# Altium schematic sheet interface.SchDoc
size A2; SheetNumber: 1; SheetTotal: 1
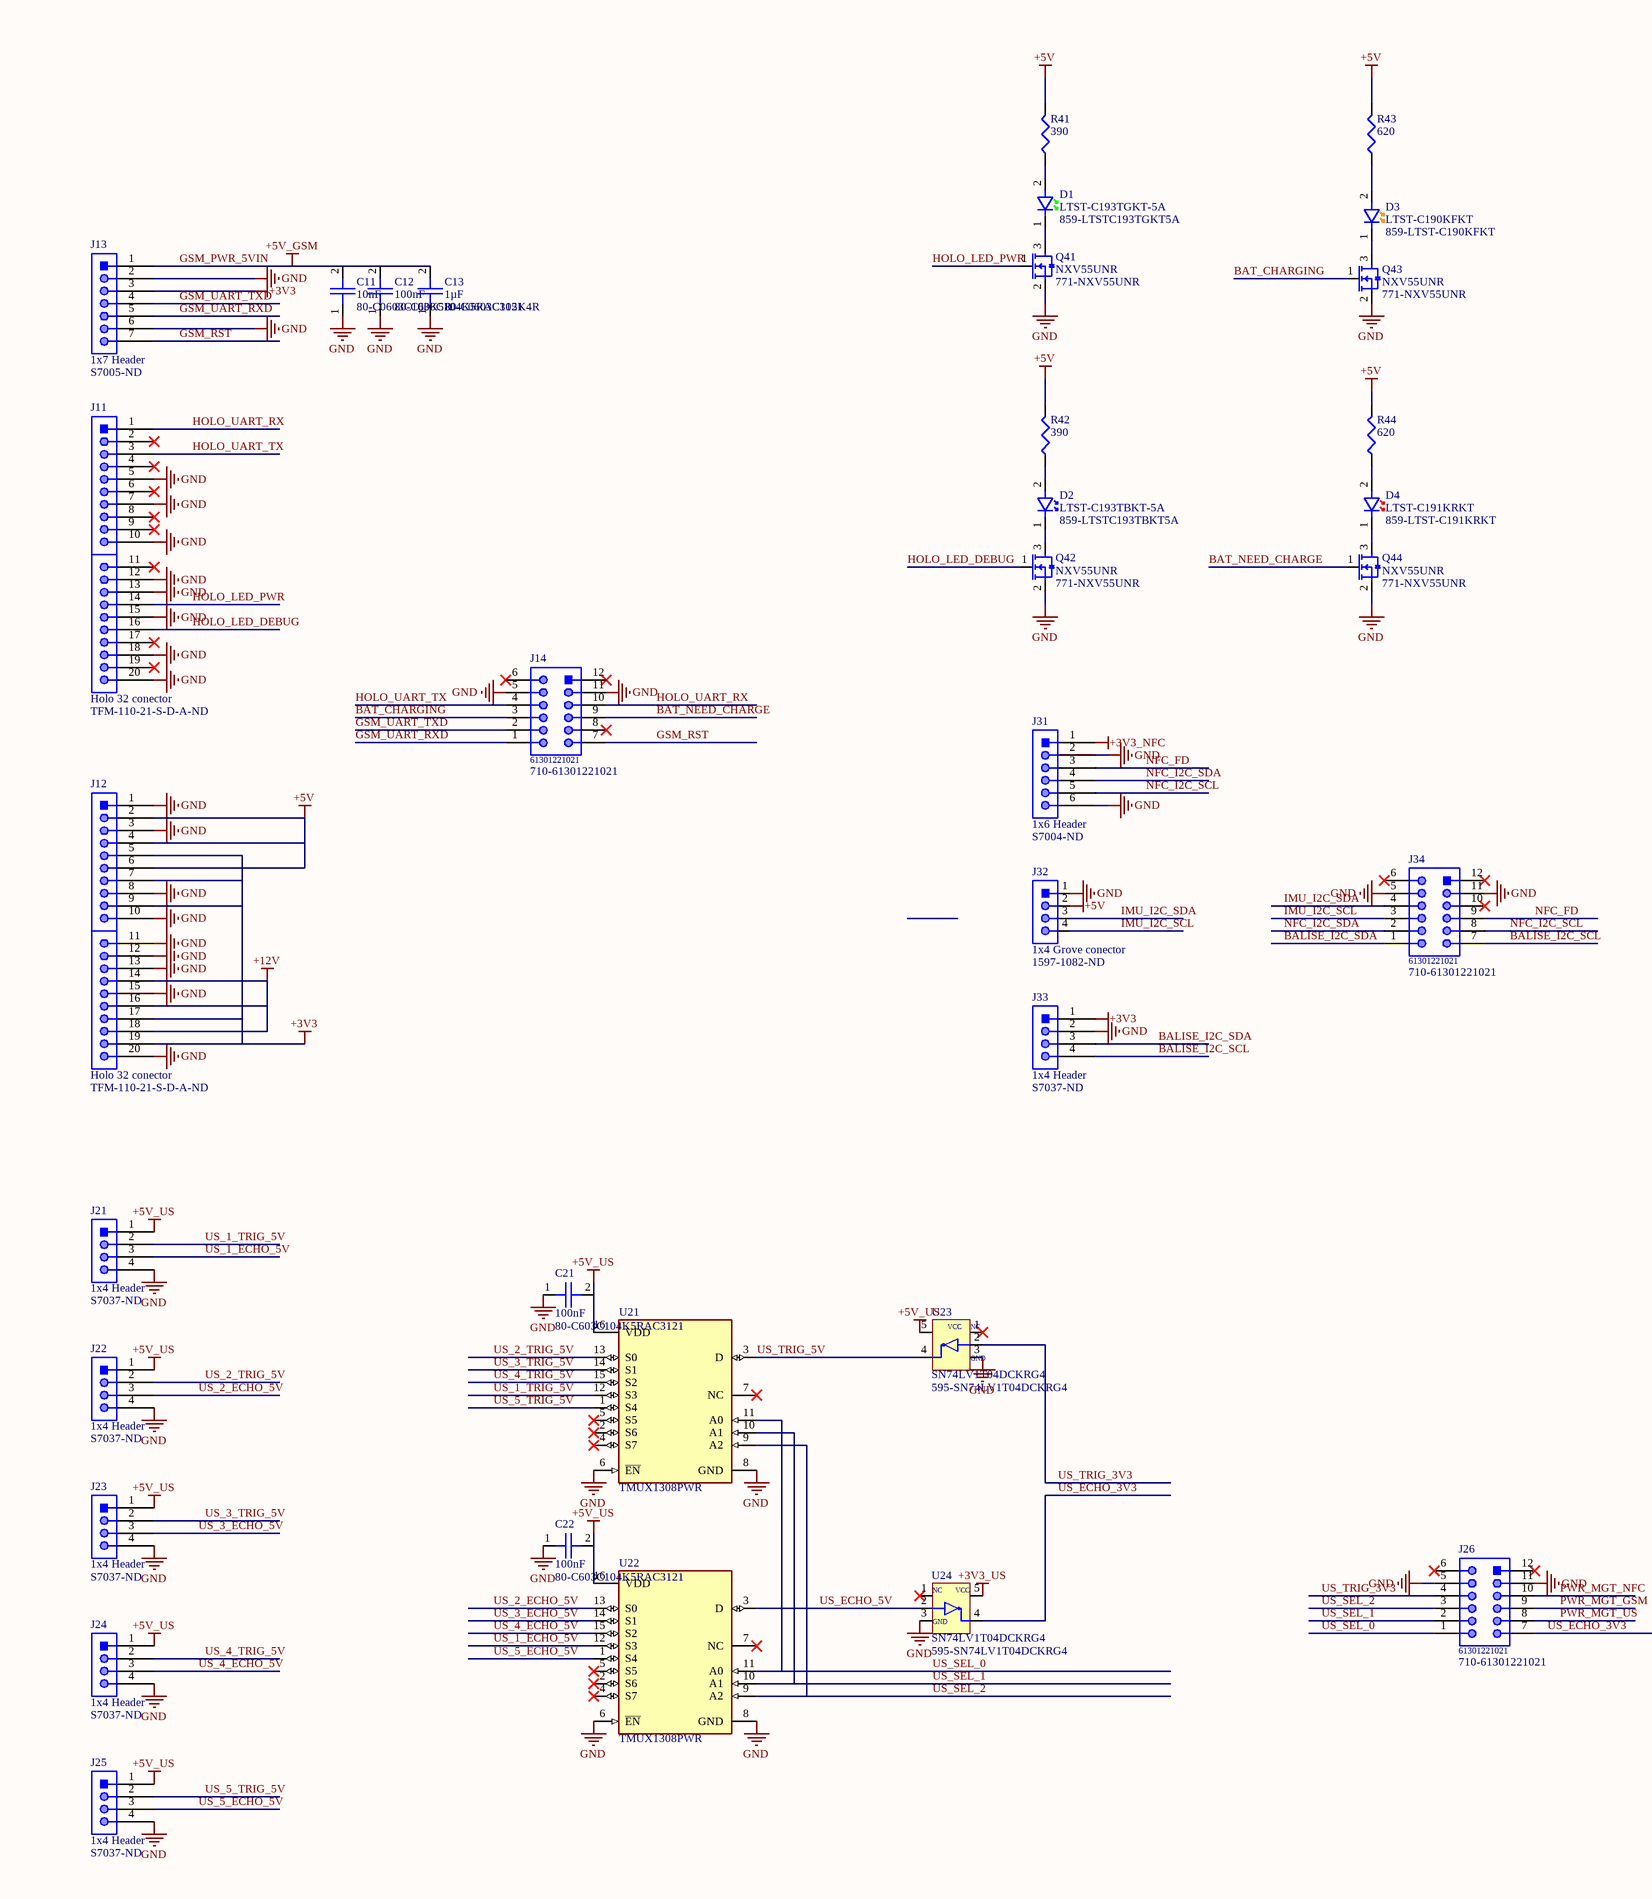
[diagram p0: interface.SchDoc, left]
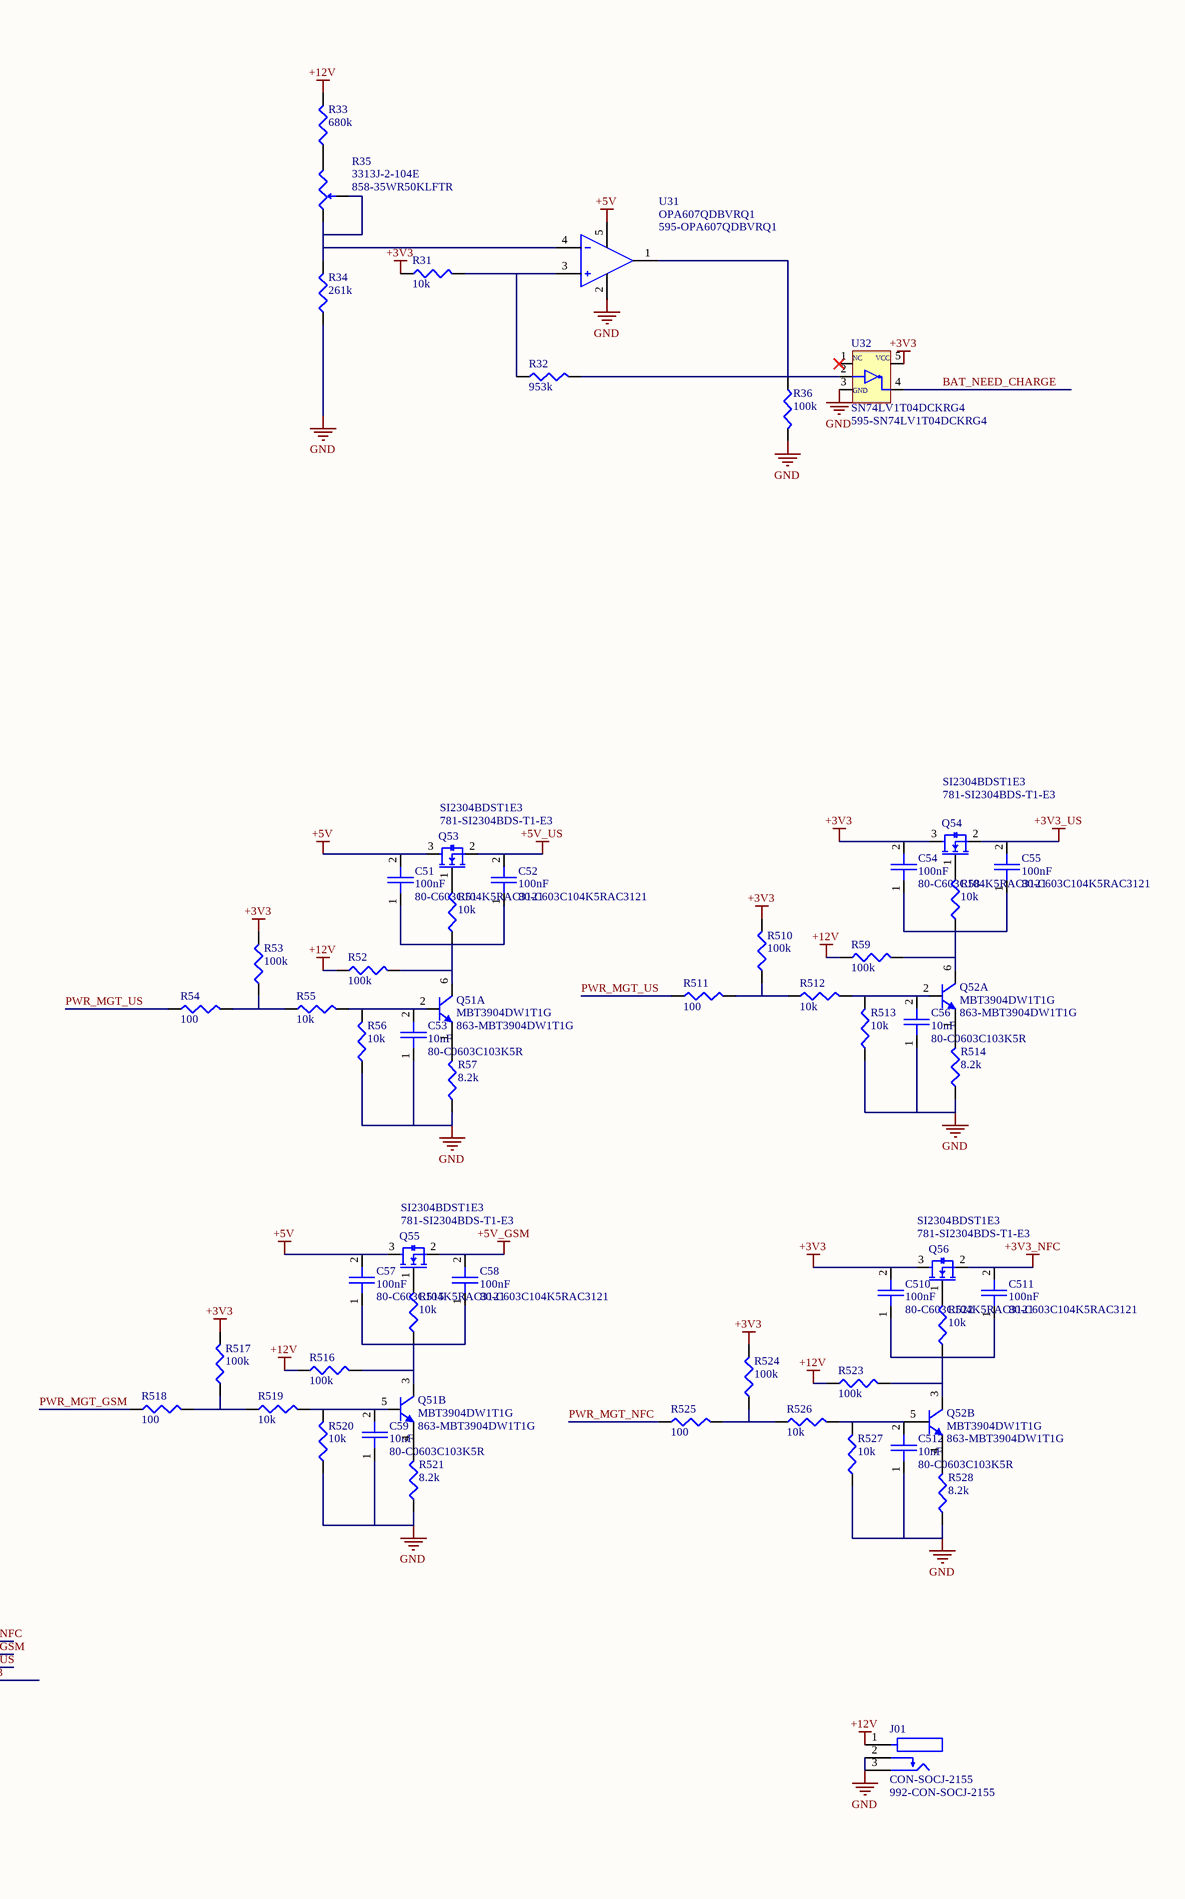
[diagram p1: interface.SchDoc, right]

## Parts
C11  10nF  Supplier Part Number 1: 80-C0603C103K5R  [FP-C0603C-CF-IPC_A]
C12  100nF  Supplier Part Number 1: 80-C603C104K5RAC3121  [FP-C0603C104K5RAC3121-IPC_A]
C13  1µF  Supplier Part Number 1: 80-C0603C105K4R  [CAPC1608X90X35NL15T15]
C21  100nF  Supplier Part Number 1: 80-C603C104K5RAC3121  [FP-C0603C104K5RAC3121-IPC_A]
C22  100nF  Supplier Part Number 1: 80-C603C104K5RAC3121  [FP-C0603C104K5RAC3121-IPC_A]
C51  100nF  Supplier Part Number 1: 80-C603C104K5RAC3121  [FP-C0603C104K5RAC3121-IPC_A]
C52  100nF  Supplier Part Number 1: 80-C603C104K5RAC3121  [FP-C0603C104K5RAC3121-IPC_A]
C53  10nF  Supplier Part Number 1: 80-C0603C103K5R  [FP-C0603C-CF-IPC_A]
C54  100nF  Supplier Part Number 1: 80-C603C104K5RAC3121  [FP-C0603C104K5RAC3121-IPC_A]
C55  100nF  Supplier Part Number 1: 80-C603C104K5RAC3121  [FP-C0603C104K5RAC3121-IPC_A]
C56  10nF  Supplier Part Number 1: 80-C0603C103K5R  [FP-C0603C-CF-IPC_A]
C57  100nF  Supplier Part Number 1: 80-C603C104K5RAC3121  [FP-C0603C104K5RAC3121-IPC_A]
C58  100nF  Supplier Part Number 1: 80-C603C104K5RAC3121  [FP-C0603C104K5RAC3121-IPC_A]
C59  10nF  Supplier Part Number 1: 80-C0603C103K5R  [FP-C0603C-CF-IPC_A]
C510  100nF  Supplier Part Number 1: 80-C603C104K5RAC3121  [FP-C0603C104K5RAC3121-IPC_A]
C511  100nF  Supplier Part Number 1: 80-C603C104K5RAC3121  [FP-C0603C104K5RAC3121-IPC_A]
C512  10nF  Supplier Part Number 1: 80-C0603C103K5R  [FP-C0603C-CF-IPC_A]
D1  LTST-C193TGKT-5A  Supplier Part Number 1: 859-LTSTC193TGKT5A  [FP-LTST-C193TGKT-5A]
D2  LTST-C193TBKT-5A  Supplier Part Number 1: 859-LTSTC193TBKT5A  [FP-LTST-C193TBKT-5A-MFG]
D3  LTST-C190KFKT  Supplier Part Number 1: 859-LTST-C190KFKT  [FP-LTST-C190KFKT-MFG]
D4  LTST-C191KRKT  Supplier Part Number 1: 859-LTST-C191KRKT  [FP-LTST-C191KRKT]
J01  CON-SOCJ-2155  Supplier Part Number 1: 992-CON-SOCJ-2155  [GRAVITECH_CON-SOCJ-2155]
J11  Holo 32 conector  Supplier Part Number 1: TFM-110-21-S-D-A-ND  [SAMTEC_TFM-110-21-S-D-A]
J12  Holo 32 conector  Supplier Part Number 1: TFM-110-21-S-D-A-ND  [SAMTEC_TFM-110-21-S-D-A]
J13  1x7 Header  Supplier Part Number 1: S7005-ND  [header 1x7]
J14  61301221021  Supplier Part Number 1: 710-61301221021  [61301221021]
J21  1x4 Header  Supplier Part Number 1: S7037-ND  [header 1x4]
J22  1x4 Header  Supplier Part Number 1: S7037-ND  [header 1x4]
J23  1x4 Header  Supplier Part Number 1: S7037-ND  [header 1x4]
J24  1x4 Header  Supplier Part Number 1: S7037-ND  [header 1x4]
J25  1x4 Header  Supplier Part Number 1: S7037-ND  [header 1x4]
J26  61301221021  Supplier Part Number 1: 710-61301221021  [61301221021]
J31  1x6 Header  Supplier Part Number 1: S7004-ND  [header 1x6]
J32  1x4 Grove conector  Supplier Part Number 1: 1597-1082-ND  [FP-110990030]
J33  1x4 Header  Supplier Part Number 1: S7037-ND  [header 1x4]
J34  61301221021  Supplier Part Number 1: 710-61301221021  [61301221021]
Q41  NXV55UNR  Supplier Part Number 1: 771-NXV55UNR  [SOT95P230X110-3N]
Q42  NXV55UNR  Supplier Part Number 1: 771-NXV55UNR  [SOT95P230X110-3N]
Q43  NXV55UNR  Supplier Part Number 1: 771-NXV55UNR  [SOT95P230X110-3N]
Q44  NXV55UNR  Supplier Part Number 1: 771-NXV55UNR  [SOT95P230X110-3N]
Q51  MBT3904DW1T1G  Supplier Part Number 1: 863-MBT3904DW1T1G  [ONSC-SOT-363-6-419B-02_W_V]  (parts A,B of 2)
Q52  MBT3904DW1T1G  Supplier Part Number 1: 863-MBT3904DW1T1G  [ONSC-SOT-363-6-419B-02_W_V]  (parts A,B of 2)
Q53  SI2304BDST1E3  Supplier Part Number 1: 781-SI2304BDS-T1-E3  [FP-SI2304BDST1E3]
Q54  SI2304BDST1E3  Supplier Part Number 1: 781-SI2304BDS-T1-E3  [FP-SI2304BDST1E3]
Q55  SI2304BDST1E3  Supplier Part Number 1: 781-SI2304BDS-T1-E3  [FP-SI2304BDST1E3]
Q56  SI2304BDST1E3  Supplier Part Number 1: 781-SI2304BDS-T1-E3  [FP-SI2304BDST1E3]
R31  10k  [RESC2013X50X30ML20T20]
R32  953k  [RESC2013X50X30ML20T20]
R33  680k  [RESC2013X50X30ML20T20]
R34  261k  [RESC2013X50X30ML20T20]
R35  3313J-2-104E  Supplier Part Number 1: 858-35WR50KLFTR  [FP-3313J-2-104E]
R36  100k  [RESC2013X50X30ML20T20]
R41  390  [RESC2013X50X30ML20T20]
R42  390  [RESC2013X50X30ML20T20]
R43  620  [RESC2013X50X30ML20T20]
R44  620  [RESC2013X50X30ML20T20]
R51  10k  [RESC2013X50X30ML20T20]
R52  100k  [RESC2013X50X30ML20T20]
R53  100k  [RESC2013X50X30ML20T20]
R54  100  [RESC2013X50X30ML20T20]
R55  10k  [RESC2013X50X30ML20T20]
R56  10k  [RESC2013X50X30ML20T20]
R57  8.2k  [RESC2013X50X30ML20T20]
R58  10k  [RESC2013X50X30ML20T20]
R59  100k  [RESC2013X50X30ML20T20]
R510  100k  [RESC2013X50X30ML20T20]
R511  100  [RESC2013X50X30ML20T20]
R512  10k  [RESC2013X50X30ML20T20]
R513  10k  [RESC2013X50X30ML20T20]
R514  8.2k  [RESC2013X50X30ML20T20]
R515  10k  [RESC2013X50X30ML20T20]
R516  100k  [RESC2013X50X30ML20T20]
R517  100k  [RESC2013X50X30ML20T20]
R518  100  [RESC2013X50X30ML20T20]
R519  10k  [RESC2013X50X30ML20T20]
R520  10k  [RESC2013X50X30ML20T20]
R521  8.2k  [RESC2013X50X30ML20T20]
R522  10k  [RESC2013X50X30ML20T20]
R523  100k  [RESC2013X50X30ML20T20]
R524  100k  [RESC2013X50X30ML20T20]
R525  100  [RESC2013X50X30ML20T20]
R526  10k  [RESC2013X50X30ML20T20]
R527  10k  [RESC2013X50X30ML20T20]
R528  8.2k  [RESC2013X50X30ML20T20]
U21  TMUX1308PWR  [FP-PW0016A-IPC_A]
U22  TMUX1308PWR  [FP-PW0016A-IPC_A]
U23  SN74LV1T04DCKRG4  Supplier Part Number 1: 595-SN74LV1T04DCKRG4  [SOT65P210X110-5N]
U24  SN74LV1T04DCKRG4  Supplier Part Number 1: 595-SN74LV1T04DCKRG4  [SOT65P210X110-5N]
U31  OPA607QDBVRQ1  Supplier Part Number 1: 595-OPA607QDBVRQ1  [FP-DBV0005A-IPC_A]
U32  SN74LV1T04DCKRG4  Supplier Part Number 1: 595-SN74LV1T04DCKRG4  [SOT65P210X110-5N]

## Nets
+3V3: C54.2 C510.2 J12.5 J12.7 J12.9 J12.17 J12.19 J13.3 J33.1 Q54.3 Q56.3 R31.1 R53.2 R510.2 R517.2 R524.2 U32.5(VCC)
+3V3_NFC: C511.2 J31.1 Q56.2
+3V3_US: C55.2 Q54.2 U24.5(VCC)
+5V: C51.2 C57.2 J12.2 J12.4 J12.6 J32.2 Q53.3 Q55.3 R41.2 R42.2 R43.2 R44.2 U31.5(VS+)
+5V_US: C21.2 C22.2 C52.2 J21.1 J22.1 J23.1 J24.1 J25.1 Q53.2 U21.16(VDD) U22.16(VDD) U23.5(VCC)
+12V: J01.1 J12.14 J12.16 J12.18 R33.2 R52.1 R59.1 R516.1 R523.1
GND: C11.1 C12.1 C13.1 C21.1 C22.1 C53.1 C56.1 C59.1 C512.1 J01.2 J01.3 J11.5 J11.7 J11.10 J11.12 J11.13 J11.15 J11.18 J11.20 J12.1 J12.3 J12.8 J12.10 J12.11 J12.12 J12.13 J12.15 J12.20 J13.2 J13.6 J14.5 J14.11 J21.4 J22.4 J23.4 J24.4 J25.4 J26.5 J26.11 J31.2 J31.6 J32.1 J33.2 J34.5 J34.11 Q41.2 Q42.2 Q43.2 Q44.2 R34.1 R36.2 R56.1 R57.1 R513.1 R514.1 R520.1 R521.1 R527.1 R528.1 U21.6(~{EN}) U21.8(GND) U22.6(~{EN}) U22.8(GND) U23.3(GND) U24.3(GND) U31.2(VS-) U32.3(GND)
GSM_PWR_5VIN: C11.2 C12.2 C13.2 C58.2 J13.1 Q55.2  [also labelled +5V_GSM]
BALISE_I2C_SCL: J33.4 J34.7
BALISE_I2C_SDA: J33.3 J34.1
BAT_CHARGING: J14.3 Q43.1
BAT_NEED_CHARGE: J14.9 Q44.1 U32.4
GSM_RST: J13.7 J14.7
GSM_UART_RXD: J13.5 J14.1
GSM_UART_TXD: J13.4 J14.2
HOLO_LED_DEBUG: J11.16 Q42.1
HOLO_LED_PWR: J11.14 Q41.1
HOLO_UART_RX: J11.1 J14.10
HOLO_UART_TX: J11.3 J14.4
IMU_I2C_SCL: J32.4 J34.3
IMU_I2C_SDA: J32.3 J34.4
NFC_FD: J31.3 J34.9
NFC_I2C_SCL: J31.5 J34.8
NFC_I2C_SDA: J31.4 J34.2
PWR_MGT_GSM: J26.9 R518.1
PWR_MGT_NFC: J26.10 R525.1
PWR_MGT_US: J26.8 R54.1 R511.1
US_1_ECHO_5V: J21.3 U22.12(S3)
US_1_TRIG_5V: J21.2 U21.12(S3)
US_2_ECHO_5V: J22.3 U22.13(S0)
US_2_TRIG_5V: J22.2 U21.13(S0)
US_3_ECHO_5V: J23.3 U22.14(S1)
US_3_TRIG_5V: J23.2 U21.14(S1)
US_4_ECHO_5V: J24.3 U22.15(S2)
US_4_TRIG_5V: J24.2 U21.15(S2)
US_5_ECHO_5V: J25.3 U22.1(S4)
US_5_TRIG_5V: J25.2 U21.1(S4)
US_ECHO_3V3: J26.7 U24.4
US_ECHO_5V: U22.3(D) U24.2
US_SEL_0: J26.1 U21.11(A0) U22.11(A0)
US_SEL_1: J26.2 U21.10(A1) U22.10(A1)
US_SEL_2: J26.3 U21.9(A2) U22.9(A2)
US_TRIG_3V3: J26.4 U23.2
US_TRIG_5V: U21.3(D) U23.4
NetC51_1: C51.1 C52.1 Q51.6(C) R51.1 R52.2
NetC53_2: C53.2 Q51.2(B) R55.2 R56.2
NetC54_1: C54.1 C55.1 Q52.6(C) R58.1 R59.2
NetC56_2: C56.2 Q52.2(B) R512.2 R513.2
NetC57_1: C57.1 C58.1 Q51.3(C) R515.1 R516.2
NetC59_2: C59.2 Q51.5(B) R519.2 R520.2
NetC510_1: C510.1 C511.1 Q52.3(C) R522.1 R523.2
NetC512_2: C512.2 Q52.5(B) R526.2 R527.2
NetD1_1: D1.1 Q41.3
NetD1_2: D1.2 R41.1
NetD2_1: D2.1 Q42.3
NetD2_2: D2.2 R42.1
NetD3_1: D3.1 Q43.3
NetD3_2: D3.2 R43.1
NetD4_1: D4.1 Q44.3
NetD4_2: D4.2 R44.1
NetQ51_1: Q51.1(E) R57.2
NetQ51_4: Q51.4(E) R521.2
NetQ52_1: Q52.1(E) R514.2
NetQ52_4: Q52.4(E) R528.2
NetQ53_1: Q53.1 R51.2
NetQ54_1: Q54.1 R58.2
NetQ55_1: Q55.1 R515.2
NetQ56_1: Q56.1 R522.2
NetR31_2: R31.2 R32.1 U31.3(IN+)
NetR32_2: R32.2 R36.1 U31.1(OUT) U32.2
NetR33_1: R33.1 R35.2
NetR34_2: R34.2 R35.1 R35.3 U31.4(IN-)
NetR53_1: R53.1 R54.2 R55.1
NetR510_1: R510.1 R511.2 R512.1
NetR517_1: R517.1 R518.2 R519.1
NetR524_1: R524.1 R525.2 R526.1

Not connected (* = marked no-connect by the designer): J11 2* 4* 6* 8* 9* 11* 17* 19*; J14 6* 8* 12*; J26 6* 12*; J34 6* 10* 12*; U21 2(S6)* 4(S7)* 5(S5)* 7(NC)*; U22 2(S6)* 4(S7)* 5(S5)* 7(NC)*; U23 1(NC)*; U24 1(NC)*; U32 1(NC)*

## Library data of the parts
C11 C53 C56 C59 C512 = C0603C103K5RACTU: CAP CER 10000PF 50V X7R 0603; Manufacturer: KEMET; Dielectric Material: Ceramic; Tolerance: 10%; Dissipation Factor: 2.5%; Supplier 1: Mouser; Manufacturer Part Number: C0603C103K5RACTU; RoHS: Yes; Category: Ceramic Capacitors; Stock 1: 1844699; Pricing 1: 1=0,16000, 10=0,07400, 50=0,07400, 100=0,03300, 500=0,02400, 1000=0,01900, 2000=0,01700, 4000=0,01500, 8000=0,01300, 10000=0,01300 (USD); Mount: Surface Mount,PCB; Case/Package: 0603; Number of Pins: 2; Case Code (Metric): 1608; Case Code (Imperial): 0603; Contact Plating: Tin,Matte; Min Operating Temperature: -55°C; Max Operating Temperature: 125°C; Capacitance: 10nF; Dielectric: X7R; Voltage Rating: 50V; Voltage Rating (DC): 50V; Packaging: Tape and Reel; Package Quantity: 4000; Termination: SMD/SMT; Voltage: 50V; Series: C0603C; Construction: Flat; Length: 1.6mm; Width: 0.8mm; Height: 0.8mm; Thickness: 0.034inch; Lead Pitch: 0.7mm; Depth: 0.8mm; Radiation Hardening: No; REACH SVHC: No SVHC; RoHS Compliant: Yes; ComponentLink1URL: https://datasheet.ciiva.com/7823/1732718-7823585.pdf?src-supplier=Element14; ComponentLink1Description: https://datasheet.ciiva.com/7823/1732718-7823585.pdf?src-supplier=Element14; ComponentLink2URL: https://datasheet.ciiva.com/5904/kem-c1002-x7r-smd-5904645.pdf?src-supplier=Farnell; ComponentLink2Description: https://datasheet.ciiva.com/5904/kem-c1002-x7r-smd-5904645.pdf?src-supplier=Farnell; ComponentLink3URL: https://datasheet.ciiva.com/7823/kem-c1002-x7r-smd-7823976.pdf?src-supplier=Element14; ComponentLink3Description: https://datasheet.ciiva.com/7823/kem-c1002-x7r-smd-7823976.pdf?src-supplier=Element14; ComponentLink4URL: https://datasheet.ciiva.com/7823/1918693-7823978.pdf?src-supplier=Element14; ComponentLink4Description: https://datasheet.ciiva.com/7823/1918693-7823978.pdf?src-supplier=Element14; ComponentLink5URL: https://datasheet.ciiva.com/28645/1851736-28645598.pdf?src-supplier=Element14; ComponentLink5Description: https://datasheet.ciiva.com/28645/1851736-28645598.pdf?src-supplier=Element14; ComponentLink6URL: https://datasheet.ciiva.com/7823/kem-c1002-x7r-smd-7823977.pdf?src-supplier=Element14; ComponentLink6Description: https://datasheet.ciiva.com/7823/kem-c1002-x7r-smd-7823977.pdf?src-supplier=Element14; ComponentLink7URL: https://datasheet.ciiva.com/14585/70095383-14585450.pdf?src-supplier=Allied+Electronics; ComponentLink7Description: https://datasheet.ciiva.com/14585/70095383-14585450.pdf?src-supplier=Allied+Electronics; ComponentLink8URL: https://datasheet.ciiva.com/5416/kem-c1002-x7r-smd-5416028.pdf?src-supplier=Mouser; ComponentLink8Description: https://datasheet.ciiva.com/5416/kem-c1002-x7r-smd-5416028.pdf?src-supplier=Mouser; ComponentLink9URL: https://datasheet.ciiva.com/39122/kem-c1002-x7r-smd-39122903.pdf?src-supplier=Onlinecomponents.com; ComponentLink9Description: https://datasheet.ciiva.com/39122/kem-c1002-x7r-smd-39122903.pdf?src-supplier=Onlinecomponents.com; ComponentLink10URL: https://datasheet.ciiva.com/18192/getdatasheetpartid-308803-18192662.pdf?src-supplier=Verical; ComponentLink10Description: https://datasheet.ciiva.com/18192/getdatasheetpartid-308803-18192662.pdf?src-supplier=Verical; ComponentLink11URL: https://datasheet.ciiva.com/18101/getdatasheetpartid-58468-18101898.pdf?src-supplier=Verical; ComponentLink11Description: https://datasheet.ciiva.com/18101/getdatasheetpartid-58468-18101898.pdf?src-supplier=Verical
C12 C21 C22 C51 C52 C54 C55 C57 C58 C510 C511 = C0603C104K5RAC3121: Cap Ceramic 0.1uF 50V X7R 10% Pad SMD 0603 125°C T/R; Manufacturer: KEMET; Supplier 1: Mouser; Manufacturer Part Number: C0603C104K5RAC3121; RoHS: Yes; Category: Ceramic Capacitors; Stock 1: 3306727; Pricing 1: 1=0,13000, 10=0,09200, 50=0,09200, 100=0,04300, 1000=0,02500, 10000=0,01900 (USD); Case/Package: 0603; RoHS Compliant: Yes
C13 = C0603C105K4RACTU: Cap Ceramic 1uF 16V X7R 10% SMD 0603 125°C Paper T/R; Manufacturer: KEMET; Dissipation Factor: 3.5%; Supplier 1: Mouser; Manufacturer Part Number: C0603C105K4RACTU; RoHS: Yes; Category: Ceramic Capacitors; Stock 1: 3280807; Pricing 1: 1=0,17000, 10=0,08000, 50=0,08000, 100=0,03600, 500=0,02600, 1000=0,02000, 2000=0,01900, 4000=0,01600, 8000=0,01400, 10000=0,01400 (USD); Mount: Surface Mount,PCB; Case/Package: 0603; Number of Pins: 2; Case Code (Metric): 1608; Case Code (Imperial): 0603; Contact Plating: Tin,Matte; Dielectric Material: Ceramic; Min Operating Temperature: -55°C; Max Operating Temperature: 125°C; Package Quantity: 4000; Capacitance: 1uF; Voltage Rating: 16V; Tolerance: 10%; Packaging: Tape and Reel; Voltage Rating (DC): 16V; Dielectric: X7R; Termination: SMD/SMT; Voltage: 16V; Series: C0603C; Construction: Flat; Length: 1.6mm; Width: 0.031inch; Height: 0.8mm; Thickness: 0.034inch; Depth: 0.8mm; Radiation Hardening: No; REACH SVHC: No SVHC; RoHS Compliant: Yes; ComponentLink1URL: https://datasheet.ciiva.com/7823/kem-c1002-x7r-smd-7823997.pdf?src-supplier=Element14; ComponentLink1Description: https://datasheet.ciiva.com/7823/kem-c1002-x7r-smd-7823997.pdf?src-supplier=Element14; ComponentLink2URL: https://datasheet.ciiva.com/22749/kem-c1002-x7r-smd-22749721.pdf?src-supplier=Element14; ComponentLink2Description: https://datasheet.ciiva.com/22749/kem-c1002-x7r-smd-22749721.pdf?src-supplier=Element14; ComponentLink3URL: https://datasheet.ciiva.com/5419/kem-c1002-x7r-smd-5419750.pdf?src-supplier=Mouser; ComponentLink3Description: https://datasheet.ciiva.com/5419/kem-c1002-x7r-smd-5419750.pdf?src-supplier=Mouser; ComponentLink4URL: https://datasheet.ciiva.com/18192/getdatasheetpartid-385479-18192732.pdf?src-supplier=Verical; ComponentLink4Description: https://datasheet.ciiva.com/18192/getdatasheetpartid-385479-18192732.pdf?src-supplier=Verical
D1 = LTST-C193TGKT-5A: 0603(H=0.35mm) 绿色 λD=520nm~535nm VR=5V VF=2.5V~3.1V IF=5mA PD=76mW; Manufacturer: Vishay Lite-On; Color: Green; Lens Color: Colorless; Forward Current: 5mA; Forward Voltage: 3.1V; Luminous Intensity: 280mcd; Viewing Angle: 130°; Lens Style: Diffused,Colorless,Rectangular; Lens Transparency: Clear; Dominant Wavelength: 535nm; Number of Elements: 1; Power Dissipation: 76mW; Reverse Voltage: 5V; Supplier 1: Mouser; Manufacturer Part Number: LTST-C193TGKT-5A; RoHS: Yes; Category: LEDs; Stock 1: 78292; Pricing 1: 1=0,44000, 10=0,27500, 50=0,27500, 100=0,15800, 1000=0,12400, 5000=0,11300, 10000=0,09600, 25000=0,09200, 50000=0,08900 (USD); Mount: Surface Mount; Case/Package: 0603; Number of Pins: 2; Case Code (Metric): 1608; Case Code (Imperial): 0603; Min Operating Temperature: -20°C; Max Operating Temperature: 80°C; Illumination Color: Green; Packaging: Tape and Reel; Package Quantity: 3000; Test Current: 5mA; Number of LEDs: 1; Series: -; Length: 1.6mm; Width: 0.8mm; Height: 0.35mm; Depth: 0.8mm; Radiation Hardening: No; Lead Free: Lead Free; RoHS Compliant: Yes; ComponentLink1URL: https://datasheet.ciiva.com/2111/ltst-c193tgkt-5a-2111818.pdf?src-supplier=Digi-Key; ComponentLink1Description: https://datasheet.ciiva.com/2111/ltst-c193tgkt-5a-2111818.pdf?src-supplier=Digi-Key; ComponentLink2URL: https://datasheet.ciiva.com/11775/0900766b80dc0555-11775617.pdf?src-supplier=RSComponents; ComponentLink2Description: https://datasheet.ciiva.com/11775/0900766b80dc0555-11775617.pdf?src-supplier=RSComponents; ComponentLink3URL: https://datasheet.ciiva.com/4689/lite-on-ltst-c193tgkt-5a-187259-4689610.pdf?src-supplier=Mouser; ComponentLink3Description: https://datasheet.ciiva.com/4689/lite-on-ltst-c193tgkt-5a-187259-4689610.pdf?src-supplier=Mouser; ComponentLink4URL: https://datasheet.ciiva.com/2111/p-100-ltst-c193tgkt-5a-2111819.pdf?src-supplier=Digi-Key; ComponentLink4Description: https://datasheet.ciiva.com/2111/p-100-ltst-c193tgkt-5a-2111819.pdf?src-supplier=Digi-Key; ComponentLink5URL: https://datasheet.ciiva.com/2111/p-100-ltst-c193tgkt-5a-2111820.pdf?src-supplier=Digi-Key; ComponentLink5Description: https://datasheet.ciiva.com/2111/p-100-ltst-c193tgkt-5a-2111820.pdf?src-supplier=Digi-Key
D2 = LTST-C193TBKT-5A: 0603(H=0.35mm) 蓝色 λD=465nm~475nm VR=5V VF=2.65V~3.05V IF=5mA PD=76mW; Manufacturer: Vishay Lite-On; Color: Blue; Lens Color: Colorless; Forward Current: 20mA; Forward Voltage: 2.8V; Luminous Intensity: 15mcd; Viewing Angle: 130°; Lens Style: Diffused,Colorless,Rectangular,Clear; Dominant Wavelength: 475nm; Test Current: 5mA; Lens Transparency: Clear; Number of Elements: 1; Power Dissipation: 76mW; Reverse Voltage: 5V; Supplier 1: Mouser; Manufacturer Part Number: LTST-C193TBKT-5A; RoHS: Yes; Category: LEDs; Stock 1: 327691; Pricing 1: 1=0,30000, 10=0,23400, 50=0,23400, 100=0,10600, 500=0,09500, 1000=0,07800, 5000=0,06700, 10000=0,05400, 25000=0,05000, 50000=0,04500 (USD); Mount: Surface Mount; Case/Package: 0603; Number of Pins: 2; Case Code (Metric): 1608; Case Code (Imperial): 0603; Min Operating Temperature: -20°C; Max Operating Temperature: 80°C; Illumination Color: Blue; Packaging: Tape and Reel; Package Quantity: 1; Number of LEDs: 1; Length: 1.6mm; Width: 0.8mm; Height: 0.35mm; Depth: 0.8mm; Radiation Hardening: No; RoHS Compliant: Yes; Lead Free: Lead Free; ComponentLink1URL: https://datasheet.ciiva.com/2111/ltst-c193tbkt-5a-2111219.pdf?src-supplier=Digi-Key; ComponentLink1Description: https://datasheet.ciiva.com/2111/ltst-c193tbkt-5a-2111219.pdf?src-supplier=Digi-Key; ComponentLink2URL: https://datasheet.ciiva.com/11773/0900766b80dc0554-11773880.pdf?src-supplier=RSComponents; ComponentLink2Description: https://datasheet.ciiva.com/11773/0900766b80dc0554-11773880.pdf?src-supplier=RSComponents; ComponentLink3URL: https://datasheet.ciiva.com/4688/lite-on-ltst-c193tbkt-5a-187386-4688832.pdf?src-supplier=Mouser; ComponentLink3Description: https://datasheet.ciiva.com/4688/lite-on-ltst-c193tbkt-5a-187386-4688832.pdf?src-supplier=Mouser; ComponentLink4URL: https://datasheet.ciiva.com/16210/ltst-c193tbkt-5a-16210824.pdf?src-supplier=Future+Electronics; ComponentLink4Description: https://datasheet.ciiva.com/16210/ltst-c193tbkt-5a-16210824.pdf?src-supplier=Future+Electronics; ComponentLink5URL: https://datasheet.ciiva.com/15201/getdatasheetpartid-293056-15201395.pdf?src-supplier=Verical; ComponentLink5Description: https://datasheet.ciiva.com/15201/getdatasheetpartid-293056-15201395.pdf?src-supplier=Verical; ComponentLink6URL: https://datasheet.ciiva.com/2111/p-100-ltst-c193tbkt-5a-2111220.pdf?src-supplier=Digi-Key; ComponentLink6Description: https://datasheet.ciiva.com/2111/p-100-ltst-c193tbkt-5a-2111220.pdf?src-supplier=Digi-Key; ComponentLink7URL: https://datasheet.ciiva.com/2111/p-100-ltst-c193tbkt-5a-2111221.pdf?src-supplier=Digi-Key; ComponentLink7Description: https://datasheet.ciiva.com/2111/p-100-ltst-c193tbkt-5a-2111221.pdf?src-supplier=Digi-Key
D3 = LTST-C190KFKT: 0603(H=0.9mm) 橙色 λD=605nm VR=5V VF=2.0V~2.4V IF=20mA PD=75mW; Manufacturer: Vishay Lite-On; Color: Orange; Lens Color: Colorless; Luminous Intensity: 90mcd; Viewing Angle: 130°; Forward Current: 30mA; Forward Voltage: 2V; Lens Style: Diffused,Colorless,Clear,Rectangular; Dominant Wavelength: 605nm; Test Current: 20mA; Lens Transparency: Clear; Number of Elements: 1; Power Dissipation: 75mW; Wavelength: 611nm; Reverse Voltage: 5V; Supplier 1: Mouser; Manufacturer Part Number: LTST-C190KFKT; RoHS: Yes; Category: LEDs; Stock 1: 88067; Pricing 1: 1=0,22000, 10=0,12300, 50=0,12300, 100=0,05700, 500=0,05300, 1000=0,04200, 4000=0,04000, 8000=0,03100, 10000=0,03100, 24000=0,02800, 48000=0,02500 (USD); Mount: Surface Mount; Case/Package: 0603; Number of Pins: 2; Case Code (Metric): 1608; Case Code (Imperial): 0603; Min Operating Temperature: -55°C; Max Operating Temperature: 85°C; Packaging: Tape and Reel; Package Quantity: 1; Illumination Color: Orange; Number of LEDs: 1; Power Rating: 75mW; Length: 3.2mm; Width: 0.8mm; Height: 0.8mm; Depth: 1.6mm; Radiation Hardening: No; RoHS Compliant: Yes; Lead Free: Lead Free; ComponentLink1URL: https://datasheet.ciiva.com/11774/0900766b80dc02a7-11774744.pdf?src-supplier=RSComponents; ComponentLink1Description: https://datasheet.ciiva.com/11774/0900766b80dc02a7-11774744.pdf?src-supplier=RSComponents; ComponentLink2URL: https://datasheet.ciiva.com/12400/100-ltst-c190kfkt-53640-12400769.pdf?src-supplier=Mouser; ComponentLink2Description: https://datasheet.ciiva.com/12400/100-ltst-c190kfkt-53640-12400769.pdf?src-supplier=Mouser; ComponentLink3URL: https://datasheet.ciiva.com/16396/lite-on20ltst-c190kfkt-16396246.pdf?src-supplier=Future+Electronics; ComponentLink3Description: https://datasheet.ciiva.com/16396/lite-on20ltst-c190kfkt-16396246.pdf?src-supplier=Future+Electronics; ComponentLink4URL: https://datasheet.ciiva.com/15201/getdatasheetpartid-309341-15201388.pdf?src-supplier=Verical; ComponentLink4Description: https://datasheet.ciiva.com/15201/getdatasheetpartid-309341-15201388.pdf?src-supplier=Verical; ComponentLink5URL: https://datasheet.ciiva.com/2109/s-110-ltst-c190kfkt-2109977.pdf?src-supplier=Digi-Key; ComponentLink5Description: https://datasheet.ciiva.com/2109/s-110-ltst-c190kfkt-2109977.pdf?src-supplier=Digi-Key; ComponentLink6URL: https://datasheet.ciiva.com/2109/s-110-ltst-c190kfkt-2109976.pdf?src-supplier=Digi-Key; ComponentLink6Description: https://datasheet.ciiva.com/2109/s-110-ltst-c190kfkt-2109976.pdf?src-supplier=Digi-Key; ComponentLink7URL: https://datasheet.ciiva.com/2109/s-110-ltst-c190kfkt-2109978.pdf?src-supplier=Digi-Key; ComponentLink7Description: https://datasheet.ciiva.com/2109/s-110-ltst-c190kfkt-2109978.pdf?src-supplier=Digi-Key
D4 = LTST-C191KRKT: 0603(H=0.65mm) 红色 λD=631nm VR=5V VF=2.0V~2.4V IF=20mA PD=75mW; Manufacturer: Vishay Lite-On; Color: Red; Lens Color: Colorless; Power Rating: 75mW; Luminous Intensity: 54mcd; Viewing Angle: 130°; Forward Voltage: 2V; Lens Style: Clear,Diffused,Colorless,Rectangular; Forward Current: 30mA; Dominant Wavelength: 631nm; Test Current: 20mA; Lens Transparency: Clear; Number of Elements: 1; Wavelength: 639nm; Reverse Voltage: 5V; Supplier 1: Mouser; Manufacturer Part Number: LTST-C191KRKT; RoHS: Yes; Category: LEDs; Stock 1: 594160; Pricing 1: 1=0,26000, 10=0,14200, 50=0,14200, 100=0,06600, 500=0,06100, 1000=0,04800, 5000=0,04600, 10000=0,03600, 25000=0,03200, 50000=0,02900 (USD); Mount: Surface Mount; Case/Package: 0603; Number of Pins: 2; Case Code (Metric): 1608; Case Code (Imperial): 0603; Min Operating Temperature: -55°C; Max Operating Temperature: 85°C; Packaging: Tape and Reel; Package Quantity: 1; Illumination Color: Red; Power Dissipation: 75mW; Number of LEDs: 1; Voltage: 2V; Length: 1.6mm; Width: 0.8mm; Height: 0.55mm; Depth: 0.8mm; Radiation Hardening: No; Lead Free: Lead Free; RoHS Compliant: Yes; ComponentLink1URL: https://datasheet.ciiva.com/11773/0900766b80dc02b2-11773601.pdf?src-supplier=RSComponents; ComponentLink1Description: https://datasheet.ciiva.com/11773/0900766b80dc02b2-11773601.pdf?src-supplier=RSComponents; ComponentLink2URL: https://datasheet.ciiva.com/12400/lite-on-ltst-c191krkt-190135-12400910.pdf?src-supplier=Mouser; ComponentLink2Description: https://datasheet.ciiva.com/12400/lite-on-ltst-c191krkt-190135-12400910.pdf?src-supplier=Mouser; ComponentLink3URL: https://datasheet.ciiva.com/16212/ltst-c191krkt-16212419.pdf?src-supplier=Future+Electronics; ComponentLink3Description: https://datasheet.ciiva.com/16212/ltst-c191krkt-16212419.pdf?src-supplier=Future+Electronics; ComponentLink4URL: https://datasheet.ciiva.com/15117/getdatasheetpartid-141922-15117737.pdf?src-supplier=Verical; ComponentLink4Description: https://datasheet.ciiva.com/15117/getdatasheetpartid-141922-15117737.pdf?src-supplier=Verical; ComponentLink5URL: https://datasheet.ciiva.com/2109/s-110-ltst-c191krkt-2109971.pdf?src-supplier=Digi-Key; ComponentLink5Description: https://datasheet.ciiva.com/2109/s-110-ltst-c191krkt-2109971.pdf?src-supplier=Digi-Key; ComponentLink6URL: https://datasheet.ciiva.com/2109/s-110-ltst-c191krkt-2109970.pdf?src-supplier=Digi-Key; ComponentLink6Description: https://datasheet.ciiva.com/2109/s-110-ltst-c191krkt-2109970.pdf?src-supplier=Digi-Key; ComponentLink7URL: https://datasheet.ciiva.com/2109/s-110-ltst-c191krkt-2109972.pdf?src-supplier=Digi-Key; ComponentLink7Description: https://datasheet.ciiva.com/2109/s-110-ltst-c191krkt-2109972.pdf?src-supplier=Digi-Key
J01 = CON-SOCJ-2155: DC Power Connectors Power Jack/Connector 2.1mm x 5.5mm; Manufacturer: Gravitech; Supplier 1: Mouser; Manufacturer Part Number: CON-SOCJ-2155; RoHS: Yes; Category: Uncategorized; Stock 1: 14426; Pricing 1: 1=1,00000, 10=1,00000, 50=1,00000, 100=1,00000, 1000=1,00000, 10000=1,00000 (USD); Color: Black; Connector Type: Power; Contact Gender: Female; ComponentLink1URL: http://www.gravitech.us/poja2x51.html?src-supplier=Mouser; ComponentLink1Description: http://www.gravitech.us/poja2x51.html?src-supplier=Mouser
J11 J12 = TFM-110-21-S-D-A: Headers & Wire Housings High-Reliability Tiger Eye Terminal Strips, .050 Pitch; Manufacturer: Samtec; Max Current Rating: 5A; Number of Contacts: 20; Max Voltage Rating (AC): 350V; Gender: Male; Pitch: 1.27mm; Supplier 1: Digi-Key; Manufacturer Part Number: TFM-110-21-S-D-A; RoHS: Yes; Category: Connectors; Stock 1: 45; Pricing 1: 1=8,39000, 35=7,16771, 105=6,64333, 455=5,59440, 945=4,89510 (USD); Housing Color: Black; Housing Material: Polymer; Contact Plating: Gold; Contact Material: Bronze; Min Operating Temperature: -55°C; Max Operating Temperature: 125°C; Packaging: Rail/Tube; Number of Rows: 2; Termination: Solder; Orientation: Straight; Length: 15.88mm; Depth: 5.72mm; REACH SVHC: No SVHC; RoHS Compliant: Yes; ComponentLink1URL: http://www.farnell.com/datasheets/2047776.pdf?src-supplier=Farnell; ComponentLink1Description: http://www.farnell.com/datasheets/2047776.pdf?src-supplier=Farnell; ComponentLink2URL: http://components.arrow.com/part/dataview/2691576S7516801N1004?src-supplier=Arrow+Electronics; ComponentLink2Description: http://components.arrow.com/part/dataview/2691576S7516801N1004?src-supplier=Arrow+Electronics; ComponentLink3URL: http://www.samtec.com/documents/webfiles/pdf/TFM_SM.PDF?src-supplier=Avnet; ComponentLink3Description: http://www.samtec.com/documents/webfiles/pdf/TFM_SM.PDF?src-supplier=Avnet
J13 = PPTC071LFBN-RC: Female, 7C, Straight, .100"CC; 3.20mm Tail, No Mt. 100u" Tin; PBT, Phos Bronze, 105 C; Manufacturer: Sullins; Number of Positions: 7; Connector Type: Header,Socket; Pitch: 0.1inch; Supplier 1: Digi-Key; Manufacturer Part Number: PPTC071LFBN-RC; RoHS: Yes; Category: Connectors; Stock 1: 23266; Pricing 1: 1=0,59000, 10=0,51500, 80=0,42438, 440=0,36900, 1000=0,30442, 5000=0,26752, 10000=0,26650 (USD); Mount: Through Hole; Contact Material: Bronze; Contact Plating: Tin; Color: Black; Housing Material: Plastic; Termination: Solder; Package Quantity: 1000; Number of Rows: 1; Packaging: Bulk; Length: 18.3mm; Width: 2.5mm; Height: 8.5mm; Lead Free: Lead Free; ComponentLink1URL: https://media.digikey.com/pdf/Data%20Sheets/Sullins%20PDFs/Female_Headers.100_DS.pdf?src-supplier=Digi-Key; ComponentLink1Description: https://media.digikey.com/pdf/Data%20Sheets/Sullins%20PDFs/Female_Headers.100_DS.pdf?src-supplier=Digi-Key; ComponentLink2URL: http://www.sullinscorp.com/catalogs/78_Page80-81_HEADER_.100_2.54mm_FEMALE.pdf?src-supplier=Future+Electronics; ComponentLink2Description: http://www.sullinscorp.com/catalogs/78_Page80-81_HEADER_.100_2.54mm_FEMALE.pdf?src-supplier=Future+Electronics
J14 J26 J34 = 61301221021: THT Angled Pin Header WR-PHD, Pitch 2.54 mm, Dual Row, 12 pins; Manufacturer: Wurth Elektronik; Pitch: 2.54mm; Gender: Male; Pin Number: 12; Working Voltage: 250VAC; Withstanding Voltage: 500VAC; Contact Resistance: 20mOhm; Rated Current: 3A; Datasheet URL: https://katalog.we-online.de/em/datasheet/6130xx21021.pdf; Orientation: Angled; Package Reference: 61301221021; Operating Temperature: -40to105degC; Part Number: 61301221021; Mounting Technology: THT; Row Number: Dual; Publisher: WurthElektronik; Packaging: Bag; Manufacturer URL: http://www.we-online.de; Supplier 1: Mouser
J21-J25 J33 = PPPC041LFBN-RC: 4 Positions Embase Connecteur 0,100 po (2,54mm) Trou traversant Or; Manufacturer: Sullins; Number of Positions: 4; Pitch: 0.1inch; Supplier 1: Digi-Key; Manufacturer Part Number: PPPC041LFBN-RC; RoHS: Yes; Category: Connectors; Stock 1: 100451; Pricing 1: 1=0,47000, 10=0,40700, 100=0,33530, 500=0,29160, 1000=0,24057, 5000=0,21141, 10000=0,21060 (USD); Mount: Through Hole; Color: Black; Contact Plating: Gold; Contact Material: Bronze; Housing Material: Plastic; Package Quantity: 1000; Number of Rows: 1; Packaging: Bulk; Termination: Solder; Connector Type: Header; Contact Type: Female Socket; Length: 10.7mm; Width: 2.5mm; Height: 8.5mm; Lead Free: Lead Free; RoHS Compliant: Yes; ComponentLink1URL: https://media.digikey.com/pdf/Data%20Sheets/Sullins%20PDFs/Female_Headers.100_DS.pdf?src-supplier=Digi-Key; ComponentLink1Description: https://media.digikey.com/pdf/Data%20Sheets/Sullins%20PDFs/Female_Headers.100_DS.pdf?src-supplier=Digi-Key; ComponentLink2URL: http://www.sullinscorp.com/catalogs/78_Page80-81_HEADER_.100_2.54mm_FEMALE.pdf?src-supplier=Future+Electronics; ComponentLink2Description: http://www.sullinscorp.com/catalogs/78_Page80-81_HEADER_.100_2.54mm_FEMALE.pdf?src-supplier=Future+Electronics
J31 = PPTC061LFBN-RC: Female, 6 C, Straight, .100"CC; 3.20mm Tail, No Mt. 100u" Tin; PBT, Phos Bronze, 105 C; Manufacturer: Sullins; Supplier 1: Digi-Key; Manufacturer Part Number: PPTC061LFBN-RC; RoHS: Yes; Category: Connectors; Stock 1: 131305; Pricing 1: 1=0,52000, 10=0,44900, 80=0,37050, 440=0,32220, 1000=0,26582, 5000=0,23360, 10000=0,23270 (USD); ComponentLink1URL: https://media.digikey.com/pdf/Data%20Sheets/Sullins%20PDFs/Female_Headers.100_DS.pdf?src-supplier=Digi-Key; ComponentLink1Description: https://media.digikey.com/pdf/Data%20Sheets/Sullins%20PDFs/Female_Headers.100_DS.pdf?src-supplier=Digi-Key; ComponentLink2URL: http://www.sullinscorp.com/catalogs/78_Page80-81_HEADER_.100_2.54mm_FEMALE.pdf?src-supplier=Future+Electronics; ComponentLink2Description: http://www.sullinscorp.com/catalogs/78_Page80-81_HEADER_.100_2.54mm_FEMALE.pdf?src-supplier=Future+Electronics
J32 = 110990030: Grove - Universal 4 pin connector [Seeed Studio] 110990030 Grove - Universal 4 pin connector; Supplier 1: Digi-Key; Manufacturer: Seeed Studio; Manufacturer Part Number: 110990030; RoHS: No; Category: Connectors; Stock 1: 3588; Pricing 1: 1=1,70000 (USD); ComponentLink1URL: http://www.mouser.com/ds/2/744/Seeed_316010005-786598.pdf?src-supplier=Mouser; ComponentLink1Description: http://www.mouser.com/ds/2/744/Seeed_316010005-786598.pdf?src-supplier=Mouser; ComponentLink2URL: https://statics3.seeedstudio.com/images/opl/datasheet/3470130P1.pdf?src-supplier=Digi-Key; ComponentLink2Description: https://statics3.seeedstudio.com/images/opl/datasheet/3470130P1.pdf?src-supplier=Digi-Key
Q41-Q44 = NXV55UNR: Transistor MOSFET N-Channel 30V 2.3A 3-Pin SOT-23; Manufacturer: Nexperia; Supplier 1: Mouser; Manufacturer Part Number: NXV55UNR; RoHS: No; Stock 1: 55565; Pricing 1: 1=0,45000, 10=0,34400, 50=0,34400, 100=0,19500, 1000=0,09900, 10000=0,06800 (USD)
Q51 Q52 = CMP-1048-00877-1: Dual General Purpose Transistors, 6-Pin SOT-363, Pb-Free, Tape and Reel; Manufacturer: On Semiconductor; Polarity: Dual NPN; fT Min (MHz): 300; IC Continuous (A): 0.2; DatasheetVersion: Rev. 9; ComponentLink2Description: Datasheet; Mounting Technology: Surface Mount; PackageReference: SOT-363-6-419B-02_W; RoHS: TRUE; ComponentLink1Description: Manufacturer URL; ComponentLink2URL: http://www.onsemi.com/pub_link/Collateral/MBT3904DW1T1-D.PDF; PackageVersion: Rev. W, 01/2006; Packing: Tape and Reel; PartNumber: MBT3904DW1T1G; ComponentLink1URL: http://www.onsemi.com/; ComponentLink3URL: http://www.onsemi.com/pub_link/Collateral/NTJD4001N-D.PDF; ComponentLink3Description: Package Specification; PackageDescription: 6-Pin Small Outline Transistor, Body 2 x 1.25 mm, Pitch 0.65 mm; Supplier 1: Mouser
Q53-Q56 = SI2304BDST1E3: Single N-Channel 30 V 0.07 Ohms Surface Mount Power Mosfet - SOT-23; Manufacturer: Vishay; On-State Resistance: 70mR; Rise Time: 12.5ns; Nominal Vgs: 1.5V; Input Capacitance: 225pF; Number of Channels: 1; Max Power Dissipation: 750mW; Drain to Source Voltage (Vdss): 30V; Continuous Drain Current (ID): 2.6A; Gate to Source Voltage (Vgs): 20V; Turn-Off Delay Time: 19ns; Turn-On Delay Time: 7.5ns; Supplier 1: Mouser; Manufacturer Part Number: SI2304BDST1E3; RoHS: Yes; Category: MOSFETs; Stock 1: 13203; Pricing 1: 1=0,67000, 10=0,57800, 50=0,57800, 100=0,43200, 500=0,33900, 1000=0,26200, 3000=0,23800, 10000=0,23800 (USD); Mount: Surface Mount; Case/Package: SOT-23; Number of Pins: 3; Weight: 0.050717oz; Min Operating Temperature: -55°C; Max Operating Temperature: 150°C; Element Configuration: Single; Packaging: Tape and Reel; Package Quantity: 1; Rds On Max: 70mR; Number of Elements: 1; Drain to Source Breakdown Voltage: 30V; Drain to Source Resistance: 70mR; Fall Time: 12.5ns; Threshold Voltage: 1.5V; Power Dissipation: 750mW; Length: 3.04mm; Width: 1.4mm; Height: 1.02mm; Radiation Hardening: No; REACH SVHC: Unknown; Lead Free: Lead Free; ComponentLink1URL: https://datasheet.ciiva.com/16225/si2304bds-16225072.pdf?src-supplier=Future+Electronics; ComponentLink1Description: https://datasheet.ciiva.com/16225/si2304bds-16225072.pdf?src-supplier=Future+Electronics; ComponentLink2URL: https://datasheet.ciiva.com/22707/1674170-22707810.pdf?src-supplier=Element14; ComponentLink2Description: https://datasheet.ciiva.com/22707/1674170-22707810.pdf?src-supplier=Element14; ComponentLink3URL: https://datasheet.ciiva.com/4439/si2304bds-107231-4439578.pdf?src-supplier=Mouser; ComponentLink3Description: https://datasheet.ciiva.com/4439/si2304bds-107231-4439578.pdf?src-supplier=Mouser; ComponentLink4URL: https://datasheet.ciiva.com/11161/si2304bds-11161450.pdf?src-supplier=Avnet; ComponentLink4Description: https://datasheet.ciiva.com/11161/si2304bds-11161450.pdf?src-supplier=Avnet; ComponentLink5URL: https://datasheet.ciiva.com/6367/si2304bds-6367035.pdf?src-supplier=Digi-Key; ComponentLink5Description: https://datasheet.ciiva.com/6367/si2304bds-6367035.pdf?src-supplier=Digi-Key; ComponentLink6URL: https://datasheet.ciiva.com/46386/1912647-46386540.pdf?src-supplier=Element14; ComponentLink6Description: https://datasheet.ciiva.com/46386/1912647-46386540.pdf?src-supplier=Element14; ComponentLink7URL: https://datasheet.ciiva.com/6367/si2304bds-6367038.pdf?src-supplier=Digi-Key; ComponentLink7Description: https://datasheet.ciiva.com/6367/si2304bds-6367038.pdf?src-supplier=Digi-Key
R31-R34 R36 R41-R44 R51-R59 R510-R528 = resistor
R35 = 35WR50KLFTR: 35W Series 3 mm Open Frame 50 kOhm ±25 % Single-Turn Trimming Potentiometer; Manufacturer: TT BI; Tolerance: 25%; Power Rating: 100mW; Resistance: 50kR; Voltage Rating: 50V; Number of Turns: 1; Insulation Resistance: 100MR; Temperature Coefficient: 250ppm/°C; Supplier 1: Mouser; Manufacturer Part Number: 35WR50KLFTR; RoHS: Yes; Category: Variable Resistors and Potentiometers; Stock 1: 1799; Pricing 1: 1=0,46000, 10=0,42200, 50=0,42200, 100=0,33800, 1000=0,26000, 10000=0,20200 (USD); Min Operating Temperature: -40°C; Max Operating Temperature: 125°C; Packaging: Tape and Reel; Package Quantity: 2000; Resistor Type: Cermet; Termination: SMD/SMT; Voltage Rating (DC): 50V; Type: Potentiometer; Width: 1.55mm; REACH SVHC: No SVHC; Lead Free: Lead Free; RoHS Compliant: Yes; ComponentLink1URL: https://datasheet.ciiva.com/8020/4701-8020823.pdf?src-supplier=Element14; ComponentLink1Description: https://datasheet.ciiva.com/8020/4701-8020823.pdf?src-supplier=Element14; ComponentLink2URL: https://datasheet.ciiva.com/7634/4701-7634925.pdf?src-supplier=Element14; ComponentLink2Description: https://datasheet.ciiva.com/7634/4701-7634925.pdf?src-supplier=Element14; ComponentLink3URL: https://datasheet.ciiva.com/12374/35-2231-12374697.pdf?src-supplier=Mouser; ComponentLink3Description: https://datasheet.ciiva.com/12374/35-2231-12374697.pdf?src-supplier=Mouser
U21 U22 = CMP-04892-000071-1: 1-CHANNEL, 8:1 GENERAL-PURPOSE A
U23 U24 U32 = SN74LV1T04DCKRG4: Single Power Supply INVERTER Gate logic level shifter 5-SC70; Manufacturer: Texas Instruments; Number of Circuits: 1; Quiescent Current: 10uA; High Level Output Current: 8mA; Propagation Delay: 7ns; Supplier 1: Mouser; Manufacturer Part Number: SN74LV1T04DCKRG4; RoHS: Yes; Category: Logic Gates; Stock 1: 13588; Pricing 1: 1=0,56000, 10=0,47800, 50=0,47800, 100=0,33100, 1000=0,21700, 10000=0,19700 (USD); Mount: Surface Mount; Min Operating Temperature: -40°C; Max Operating Temperature: 125°C; Logic Function: Inverter; Packaging: Cut Tape; Number of Inputs: 1; Low Level Output Current: 8mA; RoHS Compliant: Yes; ComponentLink1URL: http://www.ti.com/general/docs/suppproductinfo.tsp?distId=10&amp;gotoUrl=http%3A%2F%2Fwww.ti.com%2Flit%2Fgpn%2Fsn74lv1t04&src-supplier=Digi-Key; ComponentLink1Description: http://www.ti.com/general/docs/suppproductinfo.tsp?distId=10&amp;gotoUrl=http%3A%2F%2Fwww.ti.com%2Flit%2Fgpn%2Fsn74lv1t04&src-supplier=Digi-Key
U31 = OPA607QDBVRQ1: Automotive, 50-MHz, low-power, gain of 6-V/V stable, rail-to-rail output CMOS operational amplifier 5-SOT-23 -40 to 125; Manufacturer: Texas Instruments; Supplier 1: Mouser; Manufacturer Part Number: OPA607QDBVRQ1; RoHS: Yes; Stock 1: 4836; Pricing 1: 1=1,44000, 10=1,30000, 25=1,23000, 50=1,23000, 100=1,01000, 250=0,94200, 500=0,83200, 1000=0,65700, 3000=0,63500, 10000=0,63500 (USD)